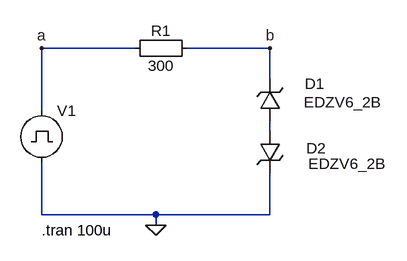
[diagram p0: schematic Z-CL-B.asc]
Z-CL-B.asc, the LTspice schematic file:
Version 4
SHEET 1 880 680
WIRE 16 48 -128 48
WIRE 224 48 96 48
WIRE 224 96 224 48
WIRE -128 144 -128 48
WIRE 224 176 224 160
WIRE -128 304 -128 224
WIRE 48 304 -128 304
WIRE 224 304 224 240
WIRE 224 304 48 304
WIRE 48 320 48 304
FLAG -128 48 a
FLAG 224 48 b
FLAG 48 320 0
SYMBOL Misc\\EuropeanResistor 0 64 R270
WINDOW 0 27 56 VTop 2
WINDOW 3 5 56 VBottom 2
SYMATTR InstName R1
SYMATTR Value 300
SYMBOL zener 240 160 R180
WINDOW 0 -68 57 Left 2
WINDOW 3 -156 29 Left 2
SYMATTR InstName D1
SYMATTR Value EDZV6_2B
SYMATTR Description Diode
SYMATTR Type diode
SYMBOL pulse -128 128 R0
WINDOW 3 24 44 Invisible 2
WINDOW 123 0 0 Left 2
WINDOW 39 0 0 Left 2
SYMATTR Value PULSE(-8V 8V 5u 1u 1u 20u 50u)
SYMATTR InstName V1
SYMBOL zener 208 176 R0
WINDOW 0 72 26 Left 2
WINDOW 3 75 50 Left 2
SYMATTR InstName D2
SYMATTR Value EDZV6_2B
SYMATTR Description Diode
SYMATTR Type diode
TEXT -128 328 Left 2 !.tran 100u

The netlist it stands for:
* Z-CL-B.asc
R1 a b 300
D1 N001 b EDZV6_2B
V1 a 0 PULSE(-8V 8V 5u 1u 1u 20u 50u)
D2 N001 0 EDZV6_2B
.model D D
.lib standard.dio
.tran 100u
.backanno
.end